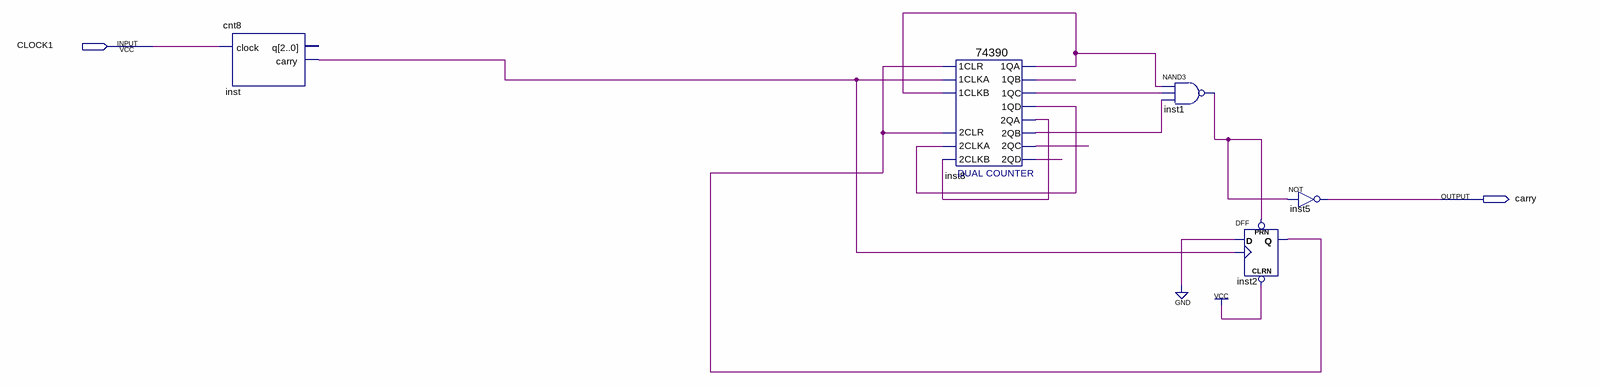
[diagram p0: schematic sheet]
// Quartus schematic m200.bdf as structural Verilog: 5 symbols, 2 pins
module m200 (
  input  CLOCK1,
  output carry
);

  wire inst1_out, inst2_q, inst8_1qa, inst8_1qb, inst8_1qc, inst8_1qd, inst8_2qa, inst8_2qb, inst8_2qc,
       inst8_2qd, inst_carry;

  cnt8 inst (.clock(CLOCK1), .carry(inst_carry));  // open: q
  \74390  inst8 (
    .\2CLKA (inst8_1qd), .\2CLR (inst2_q), .\2CLKB (inst8_2qa), .\1CLR (inst2_q), .\1CLKA (inst_carry),
    .\1CLKB (inst8_1qa), .\1QA (inst8_1qa), .\1QB (inst8_1qb), .\1QC (inst8_1qc), .\1QD (inst8_1qd),
    .\2QA (inst8_2qa), .\2QB (inst8_2qb), .\2QC (inst8_2qc), .\2QD (inst8_2qd));
  nand inst1 (inst1_out, inst8_1qa, inst8_1qc, inst8_2qb);
  DFF inst2 (.CLRN(1'b1), .CLK(inst_carry), .D(1'b0), .PRN(inst1_out), .Q(inst2_q));
  not inst5 (carry, inst1_out);
endmodule
